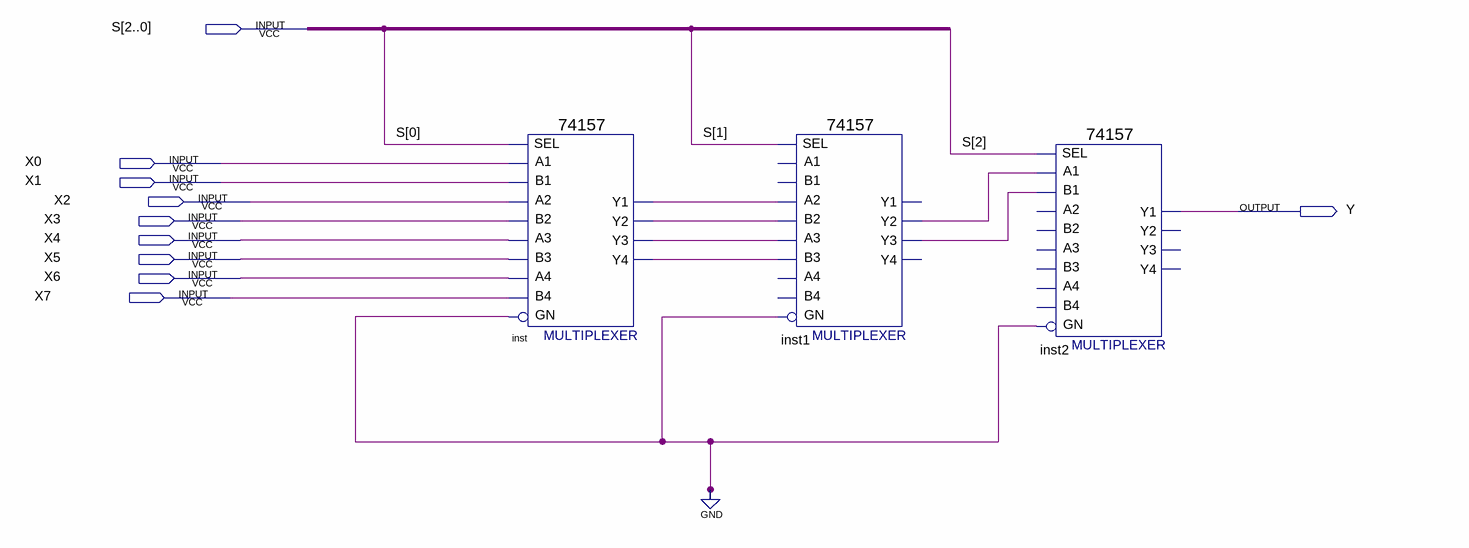
[diagram p0: schematic sheet]
// Quartus schematic primeiro.bdf as structural Verilog: 3 symbols, 10 pins
module primeiro (
  input  [2:0] S,
  input  X0,
  input  X1,
  input  X2,
  input  X3,
  input  X4,
  input  X5,
  input  X6,
  input  X7,
  output Y
);

  wire inst1_y2, inst1_y3, inst_y1, inst_y2, inst_y3, inst_y4;

  \74157  inst (
    .A1(X0), .B1(X1), .SEL(S[0]), .B2(X3), .A3(X4), .B3(X5), .A2(X2), .B4(X7), .GN(1'b0), .A4(X6),
    .Y2(inst_y2), .Y1(inst_y1), .Y4(inst_y4), .Y3(inst_y3));
  \74157  inst1 (
    .SEL(S[1]), .B2(inst_y2), .A3(inst_y3), .B3(inst_y4), .A2(inst_y1), .GN(1'b0), .Y2(inst1_y2),
    .Y3(inst1_y3));  // open: A1, B1, B4, A4, Y1, Y4
  \74157  inst2 (
    .A1(inst1_y2), .B1(inst1_y3), .SEL(S[2]), .GN(1'b0), .Y1(Y));  // open: B2, A3, B3, A2, B4, A4, Y2, Y4, Y3
endmodule
